# Altium schematic sheet norbi_lm_mem.SchDoc: Имя
size 209 x 297 mm; ApprovedBy: Утвердил; CheckedBy: Проверил; Author: Разработал; Organization: НГУ; DocumentNumber: Децимальный номер Э3; SheetNumber: Лист; SheetTotal: Листов; PageSetup: Record=PageOptions|CenterHorizontal=True|CenterVertical=True|PrintScale=1.00|XCorrection=1.00|YCorrection=1.00|PrintKind=1|BorderSize=5000000|LeftOffset=0|BottomOffset=0|Orientation=2|PaperLength=1000|PaperWidth=1000|Scale=100|PaperSource=15|PrintQuality=1200|MediaType=1|DitherType=10|PaperKind=A3|PrintScaleMode=1; Weight: -; ScaleFactor: -; NormInspection: Норм.Контр.
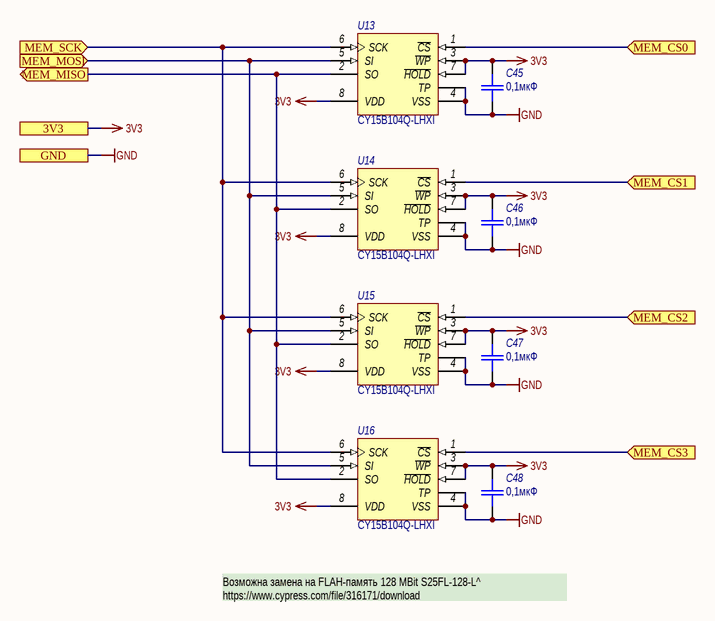
[diagram p0: norbi_lm_mem.SchDoc]

## Parts
C45  0,1мкФ  [CR-0603]
C46  0,1мкФ  [CR-0603]
C47  0,1мкФ  [CR-0603]
C48  0,1мкФ  [CR-0603]
U13  Наименование: CY15B104Q-LHXI  [TDFN-8]  (hidden comment: FM25V20)
U14  Наименование: CY15B104Q-LHXI  [TDFN-8]  (hidden comment: FM25V20)
U15  Наименование: CY15B104Q-LHXI  [TDFN-8]  (hidden comment: FM25V20)
U16  Наименование: CY15B104Q-LHXI  [TDFN-8]  (hidden comment: FM25V20)

## Ports
3V3, GND, MEM_CS0 (in), MEM_CS1 (in), MEM_CS2 (in), MEM_CS3 (in), MEM_MISO (out), MEM_MOSI (in), MEM_SCK (in)

## Nets
3V3: C45.2 C46.2 C47.2 C48.2 U13.3(~{WP}) U13.7(~{HOLD}) U13.8(VDD) U14.3(~{WP}) U14.7(~{HOLD}) U14.8(VDD) U15.3(~{WP}) U15.7(~{HOLD}) U15.8(VDD) U16.3(~{WP}) U16.7(~{HOLD}) U16.8(VDD) ; port 3V3
GND: C45.1 C46.1 C47.1 C48.1 U13.4(VSS) U13.TP U14.4(VSS) U14.TP U15.4(VSS) U15.TP U16.4(VSS) U16.TP ; port GND
MEM_CS0: U13.1(~{CS}) ; port MEM_CS0
MEM_CS1: U14.1(~{CS}) ; port MEM_CS1
MEM_CS2: U15.1(~{CS}) ; port MEM_CS2
MEM_CS3: U16.1(~{CS}) ; port MEM_CS3
MEM_MISO: U13.2(SO) U14.2(SO) U15.2(SO) U16.2(SO) ; port MEM_MISO
MEM_MOSI: U13.5(SI) U14.5(SI) U15.5(SI) U16.5(SI) ; port MEM_MOSI
MEM_SCK: U13.6(SCK) U14.6(SCK) U15.6(SCK) U16.6(SCK) ; port MEM_SCK

## Notes on the sheet
- Возможна замена на FLAH-память 128 MBit S25FL-128-L^
  https://www.cypress.com/file/316171/download
- Подп. и дата
- Инв. № дубл.
- Взам. инв. №
- Инв. № подл.
- Изм.
- Лист
- № докум.
- Подп.
- Дата
- Форма 2а ГОСТ 2.104-2006
- Копировал
- Формат А4

## Library data of the parts
C45-C48 = C_smd: Конденсатор для поверхностного монтажа; Назначение: Чип-конденсатор; Потребление, Вт: 0; Наименование: SMD-0603; Value: 0,1мкФ
U13-U16 = FM25V: 2Mb Serial 3V FRAM Memory; Назначение: 4Mb Serial 3V FRAM Memory; Потребление, Вт: 0,009; ComponentLink1Description: Datasheet
  U13: ComponentLink1URL: https://www.cypress.com/file/209146/download
  U14-U16: ComponentLink1URL: https://www.cypress.com/file/136456/download